# EAGLE schematic Enclosure 95x65 PB (EAGLE 9.6.2)
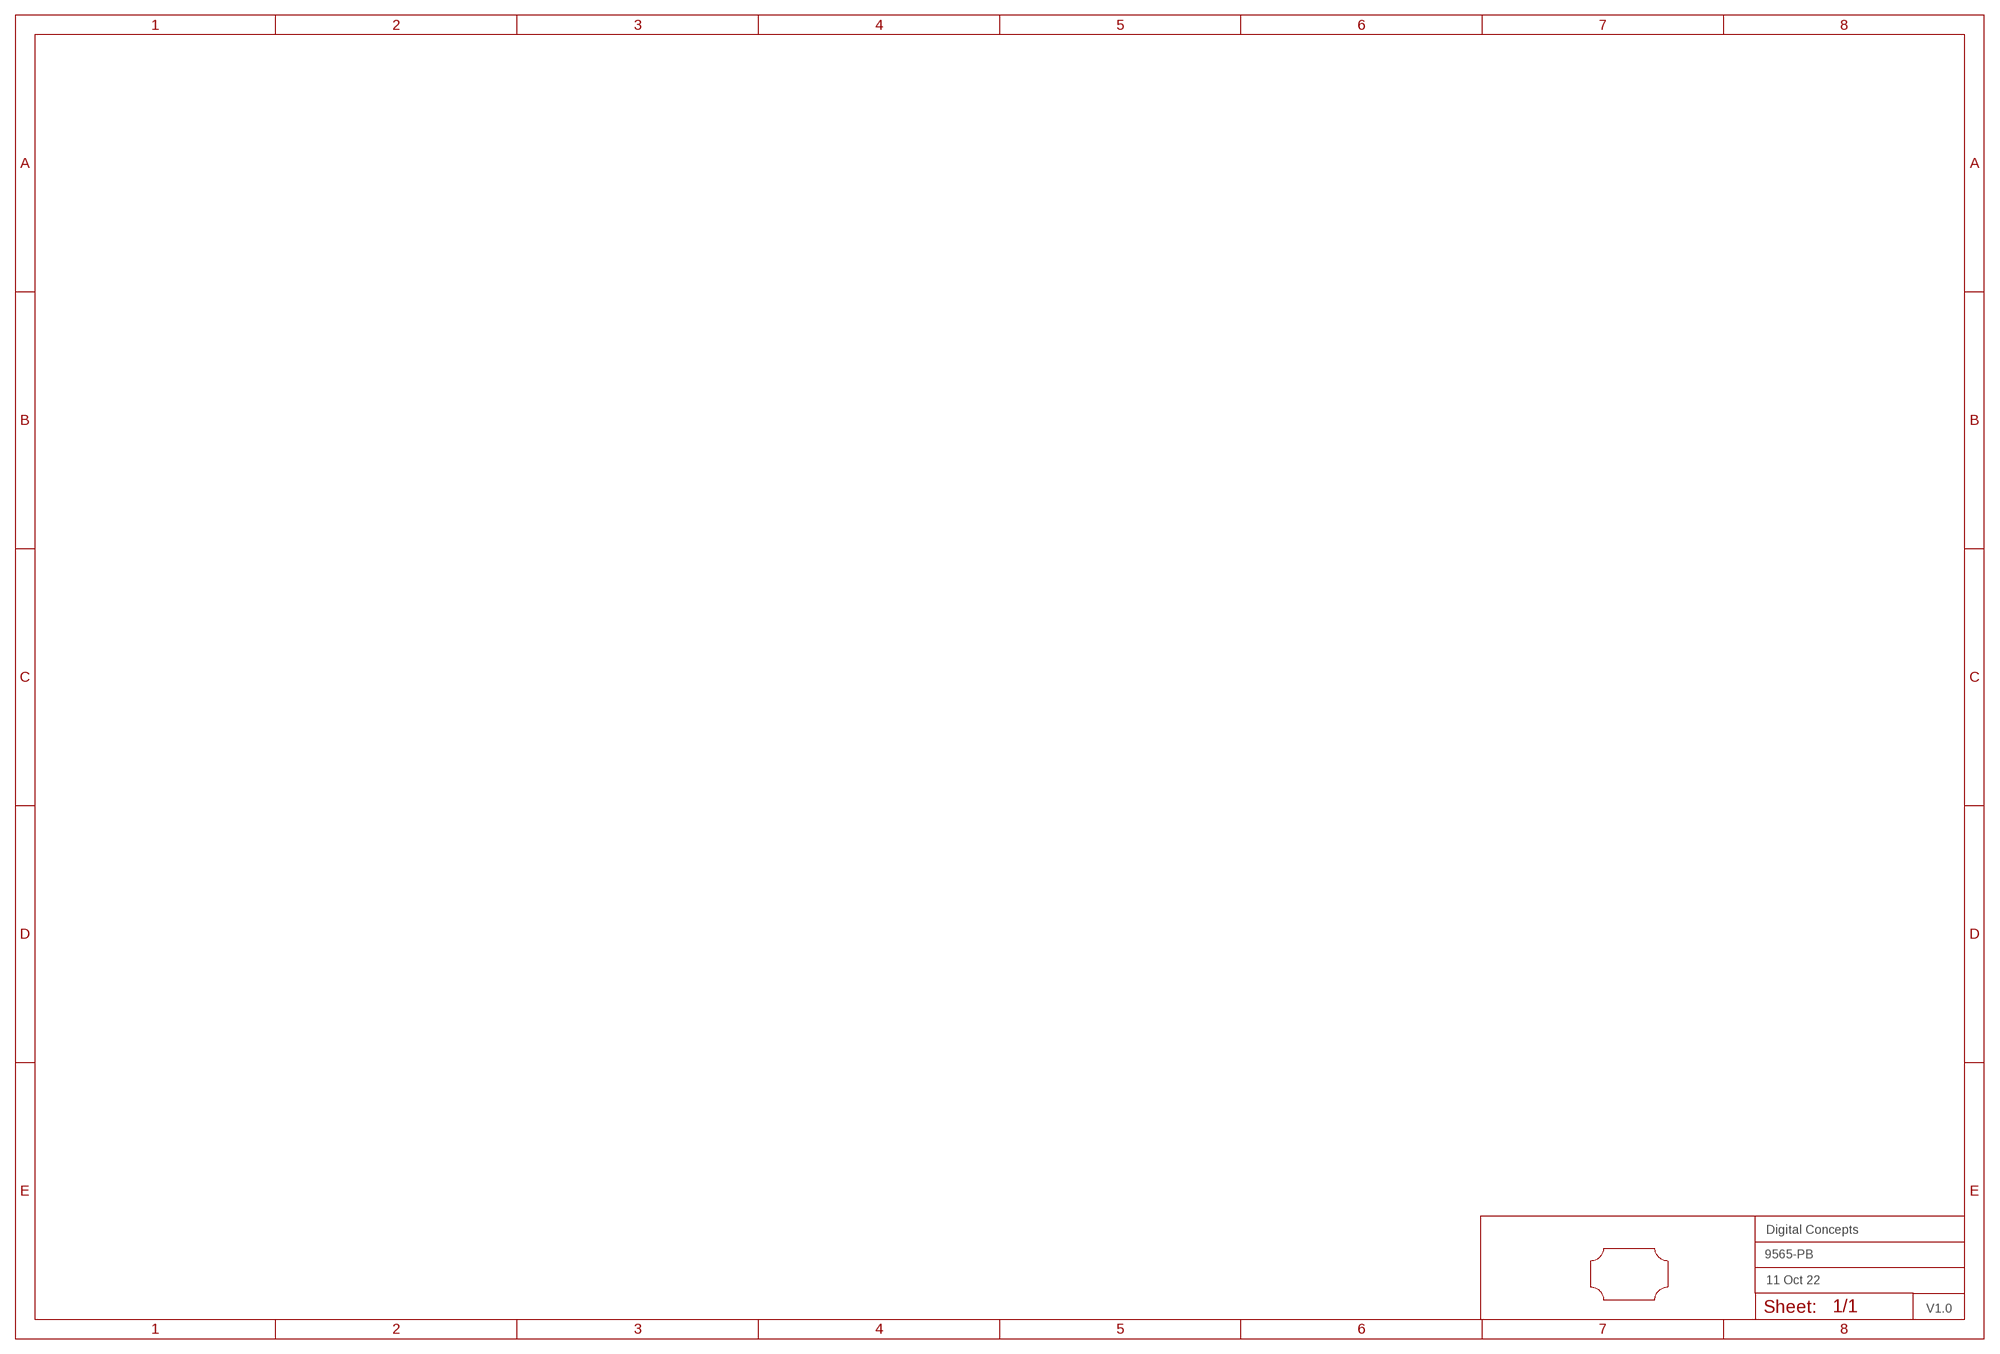
[diagram p0: schematic, sheet 1]
FRAME2 (A3L-LOC): DATE: 11 Oct 22; OWNER: Digital Concepts; TITLE: 9565-PB; VERSION: V1.0

## Parts
U$1  PROTO-32X21  [PROTO-90X60]

## Library data of the parts
U$1 = digitalconcepts:PROTO-32X21: Prototyping board with 32x21 pad matrix for 90 x 60 enclosure